# Altium schematic sheet mic.SchDoc
size 297 x 209 mm; ProjectSection: Set ProjectSection in Document Parameters; PageSetup: Record=PageOptions|CenterHorizontal=True|CenterVertical=True|PrintScale=1.00|XCorrection=1.00|YCorrection=1.00|PrintKind=1|BorderSize=5000000|LeftOffset=0|BottomOffset=0|Orientation=2|PaperLength=1000|PaperWidth=1000|Scale=100|PaperSource=7|PrintQuality=1200|MediaType=1|DitherType=10|PaperKind=A4|PrintScaleMode=1
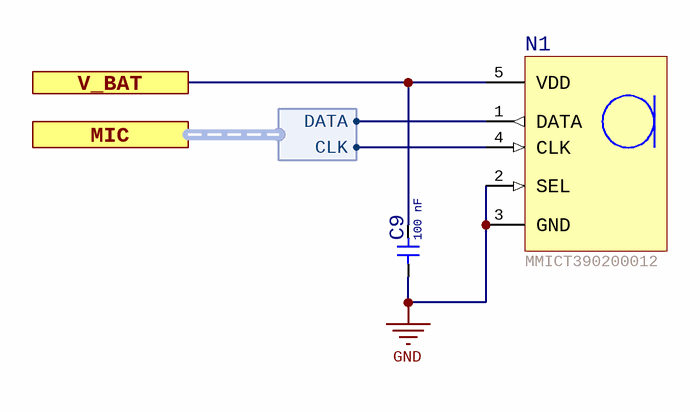
[diagram p0: mic.SchDoc]

## Parts
C9  value 100 nF  [1608C]  (hidden comment: CAP-NP)
N1  Manufacturer P/N: MMICT390200012  [SNS-MIC-T3902]  (hidden comment: SNS-MIC-T3902)

## Ports
MIC (harness MIC), V_BAT

## Harnesses
MIC: DATA, CLK

## Nets
GND: C9.1 N1.2(SEL) N1.3(GND)
V_BAT: C9.2 N1.5(VDD) ; port V_BAT
NetN1_1: N1.1(DATA) ; port MIC.DATA
NetN1_4: N1.4(CLK) ; port MIC.CLK

## Notes on the sheet
- Project
- Customer
- File Name
- Part
- Section
- Revision (File)
- Variant
- Revision (Project)
- Date
- Sheet
- Contronix GmbH <https://contronix.de>
- Nizzastr. 6, 01445 Radebeul

## Library data of the parts
C9 = CAP-100n-16V-10%-X7R-1608: SMD ceramic capacitor; Manufacturer: Samsung; Manufacturer P/N: CL10B104KO8NNNC; hasAltManufacturer: 0; Contronix P/N: C41RLV; autIdem: 255; NozzleType: 701/901; FeederType: Tape 8mm; FeederPitch: 4mm; NumberOfPins: 2; NumberOfRows: 1; Voltage: 16; Tolerance: 10%; PackageCNTX: 1608; CapacitanceSI: 1E-7; Design Item Id: CAP-100n-16V-10%-X7R-1608; Stock: 700; Price: 0,09; Price (€): 0,09; A I: 255; Supplier 1: Digi-Key; Supplier Part Number 1: 1276-1005-1-ND; Modified: 07.07.2020 16:43:22; Obsolete: 0; Voltage (V): 16; PackageManufacturer: 1608; MountingType: SMT; polarized: 0; Manufacturer Part Number: CL10B104KO8NNNC
N1 = N36NTX: Bottom Port PDM Low‐Power Multi‐Mode Microphone With High AOP Mode; Manufacturer: InvenSense; hasAltManufacturer: 0; Contronix P/N: N36NTX; NumberOfPins: 5; NumberOfRows: 2; VoltageMin: 1,65; VoltageMax: 3,6; PhysicalProperty: Sound; Rev: =VersionControl_RevNumber; Design Item Id: SNS-MIC-T3902; Manufacturer Part Number: MMICT390200012; Price: 0,85; Price (€): 0,85; ComponentLink1Description: Manufacturer Datasheet; ComponentLink1URL: http://invensense.tdk.com/wp-content/uploads/2020/05/DS-000357-T3902-v1.0.pdf; Supplier 1: Digi-Key; Supplier Part Number 1: 1428-MMICT390200012CT-ND; Created: 08.10.2020 15:24:47; Modified: 08.10.2020 16:48:36; Obsolete: 0; MountingType: SMT